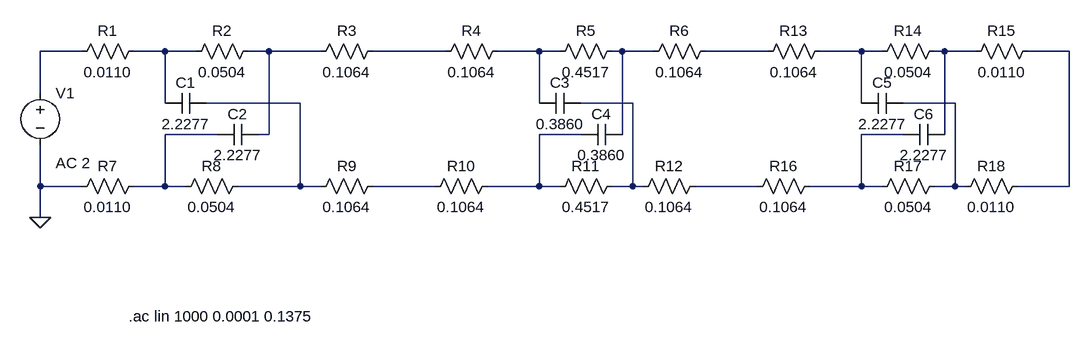
[diagram p0: schematic 3xRC_lattice.asc]
3xRC_lattice.asc, the LTspice schematic file:
Version 4
SHEET 1 1508 680
WIRE -96 96 -160 96
WIRE 32 96 -16 96
WIRE 80 96 32 96
WIRE 192 96 160 96
WIRE 272 96 192 96
WIRE 464 96 352 96
WIRE 608 96 544 96
WIRE 640 96 608 96
WIRE 736 96 720 96
WIRE 784 96 736 96
WIRE 960 96 864 96
WIRE 1104 96 1040 96
WIRE 1136 96 1104 96
WIRE 1232 96 1216 96
WIRE 1280 96 1232 96
WIRE 1424 96 1360 96
WIRE -160 160 -160 96
WIRE 32 176 32 96
WIRE 240 176 96 176
WIRE 608 176 608 96
WIRE 752 176 672 176
WIRE 1104 176 1104 96
WIRE 1248 176 1168 176
WIRE 112 224 32 224
WIRE 192 224 192 96
WIRE 192 224 176 224
WIRE 672 224 608 224
WIRE 736 224 736 96
WIRE 1168 224 1104 224
WIRE 1232 224 1232 96
WIRE -160 304 -160 240
WIRE -96 304 -160 304
WIRE 32 304 32 224
WIRE 32 304 -16 304
WIRE 64 304 32 304
WIRE 240 304 240 176
WIRE 240 304 144 304
WIRE 272 304 240 304
WIRE 448 304 352 304
WIRE 608 304 608 224
WIRE 608 304 528 304
WIRE 640 304 608 304
WIRE 752 304 752 176
WIRE 752 304 720 304
WIRE 768 304 752 304
WIRE 944 304 848 304
WIRE 1104 304 1104 224
WIRE 1104 304 1024 304
WIRE 1136 304 1104 304
WIRE 1248 304 1248 176
WIRE 1248 304 1216 304
WIRE 1264 304 1248 304
WIRE 1424 304 1424 96
WIRE 1424 304 1344 304
WIRE -160 352 -160 304
FLAG -160 352 0
SYMBOL res 0 80 R90
WINDOW 0 0 56 VBottom 2
WINDOW 3 32 56 VTop 2
SYMATTR InstName R1
SYMATTR Value 0.0110
SYMBOL res 176 80 R90
WINDOW 0 0 56 VBottom 2
WINDOW 3 32 56 VTop 2
SYMATTR InstName R2
SYMATTR Value 0.0504
SYMBOL res 368 80 R90
WINDOW 0 0 56 VBottom 2
WINDOW 3 32 56 VTop 2
SYMATTR InstName R3
SYMATTR Value 0.1064
SYMBOL res 560 80 R90
WINDOW 0 0 56 VBottom 2
WINDOW 3 32 56 VTop 2
SYMATTR InstName R4
SYMATTR Value 0.1064
SYMBOL res 736 80 R90
WINDOW 0 0 56 VBottom 2
WINDOW 3 32 56 VTop 2
SYMATTR InstName R5
SYMATTR Value 0.4517
SYMBOL res 880 80 R90
WINDOW 0 0 56 VBottom 2
WINDOW 3 32 56 VTop 2
SYMATTR InstName R6
SYMATTR Value 0.1064
SYMBOL res 0 288 R90
WINDOW 0 0 56 VBottom 2
WINDOW 3 32 56 VTop 2
SYMATTR InstName R7
SYMATTR Value 0.0110
SYMBOL res 160 288 R90
WINDOW 0 0 56 VBottom 2
WINDOW 3 32 56 VTop 2
SYMATTR InstName R8
SYMATTR Value 0.0504
SYMBOL res 368 288 R90
WINDOW 0 0 56 VBottom 2
WINDOW 3 32 56 VTop 2
SYMATTR InstName R9
SYMATTR Value 0.1064
SYMBOL res 544 288 R90
WINDOW 0 0 56 VBottom 2
WINDOW 3 32 56 VTop 2
SYMATTR InstName R10
SYMATTR Value 0.1064
SYMBOL res 736 288 R90
WINDOW 0 0 56 VBottom 2
WINDOW 3 32 56 VTop 2
SYMATTR InstName R11
SYMATTR Value 0.4517
SYMBOL res 864 288 R90
WINDOW 0 0 56 VBottom 2
WINDOW 3 32 56 VTop 2
SYMATTR InstName R12
SYMATTR Value 0.1064
SYMBOL cap 96 160 R90
WINDOW 0 0 32 VBottom 2
WINDOW 3 32 32 VTop 2
SYMATTR InstName C1
SYMATTR Value 2.2277
SYMBOL cap 176 208 R90
WINDOW 0 0 32 VBottom 2
WINDOW 3 32 32 VTop 2
SYMATTR InstName C2
SYMATTR Value 2.2277
SYMBOL cap 672 160 R90
WINDOW 0 0 32 VBottom 2
WINDOW 3 32 32 VTop 2
SYMATTR InstName C3
SYMATTR Value 0.3860
SYMBOL cap 736 208 R90
WINDOW 0 0 32 VBottom 2
WINDOW 3 32 32 VTop 2
SYMATTR InstName C4
SYMATTR Value 0.3860
SYMBOL res 1056 80 R90
WINDOW 0 0 56 VBottom 2
WINDOW 3 32 56 VTop 2
SYMATTR InstName R13
SYMATTR Value 0.1064
SYMBOL res 1232 80 R90
WINDOW 0 0 56 VBottom 2
WINDOW 3 32 56 VTop 2
SYMATTR InstName R14
SYMATTR Value 0.0504
SYMBOL res 1376 80 R90
WINDOW 0 0 56 VBottom 2
WINDOW 3 32 56 VTop 2
SYMATTR InstName R15
SYMATTR Value 0.0110
SYMBOL res 1040 288 R90
WINDOW 0 0 56 VBottom 2
WINDOW 3 32 56 VTop 2
SYMATTR InstName R16
SYMATTR Value 0.1064
SYMBOL res 1232 288 R90
WINDOW 0 0 56 VBottom 2
WINDOW 3 32 56 VTop 2
SYMATTR InstName R17
SYMATTR Value 0.0504
SYMBOL res 1360 288 R90
WINDOW 0 0 56 VBottom 2
WINDOW 3 32 56 VTop 2
SYMATTR InstName R18
SYMATTR Value 0.0110
SYMBOL cap 1168 160 R90
WINDOW 0 0 32 VBottom 2
WINDOW 3 32 32 VTop 2
SYMATTR InstName C5
SYMATTR Value 2.2277
SYMBOL cap 1232 208 R90
WINDOW 0 0 32 VBottom 2
WINDOW 3 32 32 VTop 2
SYMATTR InstName C6
SYMATTR Value 2.2277
SYMBOL voltage -160 144 R0
WINDOW 123 24 124 Left 2
WINDOW 39 0 0 Left 0
SYMATTR Value2 AC 2
SYMATTR InstName V1
SYMATTR Value ""
TEXT -24 504 Left 2 !.ac lin 1000 0.0001 0.1375

The netlist it stands for:
* 3xRC_lattice.asc
R1 N002 N001 0.0110
R2 N003 N002 0.0504
R3 N004 N003 0.1064
R4 N005 N004 0.1064
R5 N006 N005 0.4517
R6 N007 N006 0.1064
R7 N014 0 0.0110
R8 N011 N014 0.0504
R9 N017 N011 0.1064
R10 N015 N017 0.1064
R11 N012 N015 0.4517
R12 N018 N012 0.1064
C1 N011 N002 2.2277
C2 N003 N014 2.2277
C3 N012 N005 0.3860
C4 N006 N015 0.3860
R13 N008 N007 0.1064
R14 N009 N008 0.0504
R15 N010 N009 0.0110
R16 N016 N018 0.1064
R17 N013 N016 0.0504
R18 N010 N013 0.0110
C5 N013 N008 2.2277
C6 N009 N016 2.2277
V1 N001 0 AC 2
.ac lin 1000 0.0001 0.1375
.backanno
.end